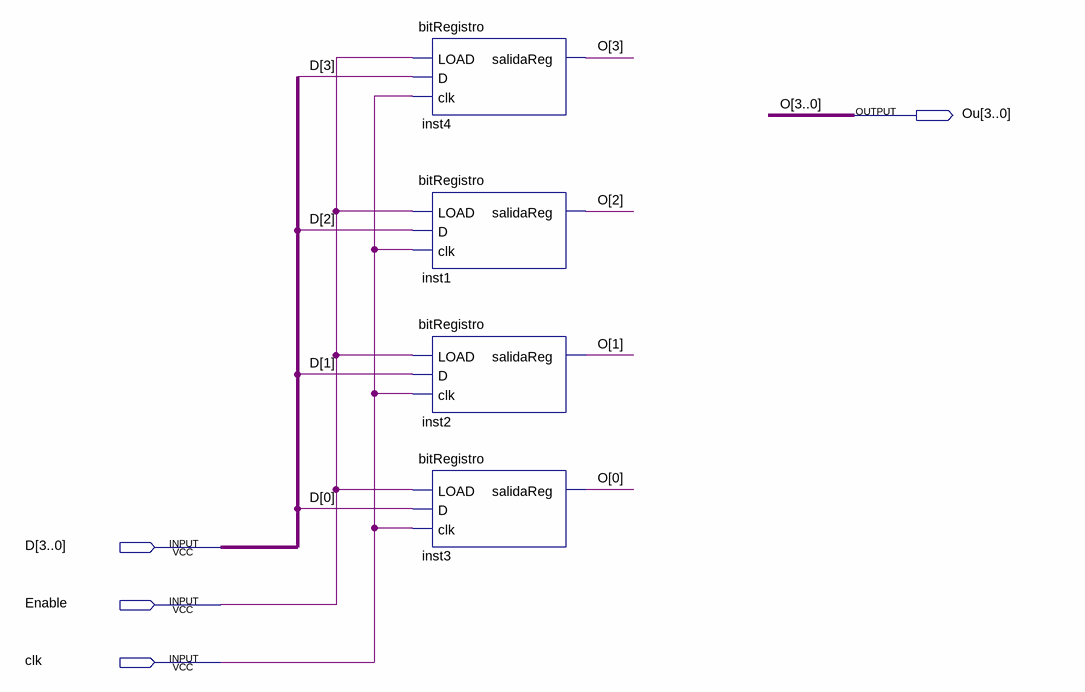
[diagram p0: schematic sheet]
// Quartus schematic Registro4Bits.bdf as structural Verilog: 4 symbols, 4 pins
module Registro4Bits (
  input  [3:0] D,
  input  Enable,
  input  clk,
  output [3:0] Ou
);

  bitRegistro inst4 (.LOAD(Enable), .D(D[3]), .clk(clk), .salidaReg(Ou[3]));
  bitRegistro inst1 (.LOAD(Enable), .D(D[2]), .clk(clk), .salidaReg(Ou[2]));
  bitRegistro inst2 (.LOAD(Enable), .D(D[1]), .clk(clk), .salidaReg(Ou[1]));
  bitRegistro inst3 (.LOAD(Enable), .D(D[0]), .clk(clk), .salidaReg(Ou[0]));

  // Other names for the same wires on the sheet: O[3:0] = Ou
endmodule
